# EAGLE board Bhoreal Slimpro (EAGLE 7.7.0), part 1 of 4
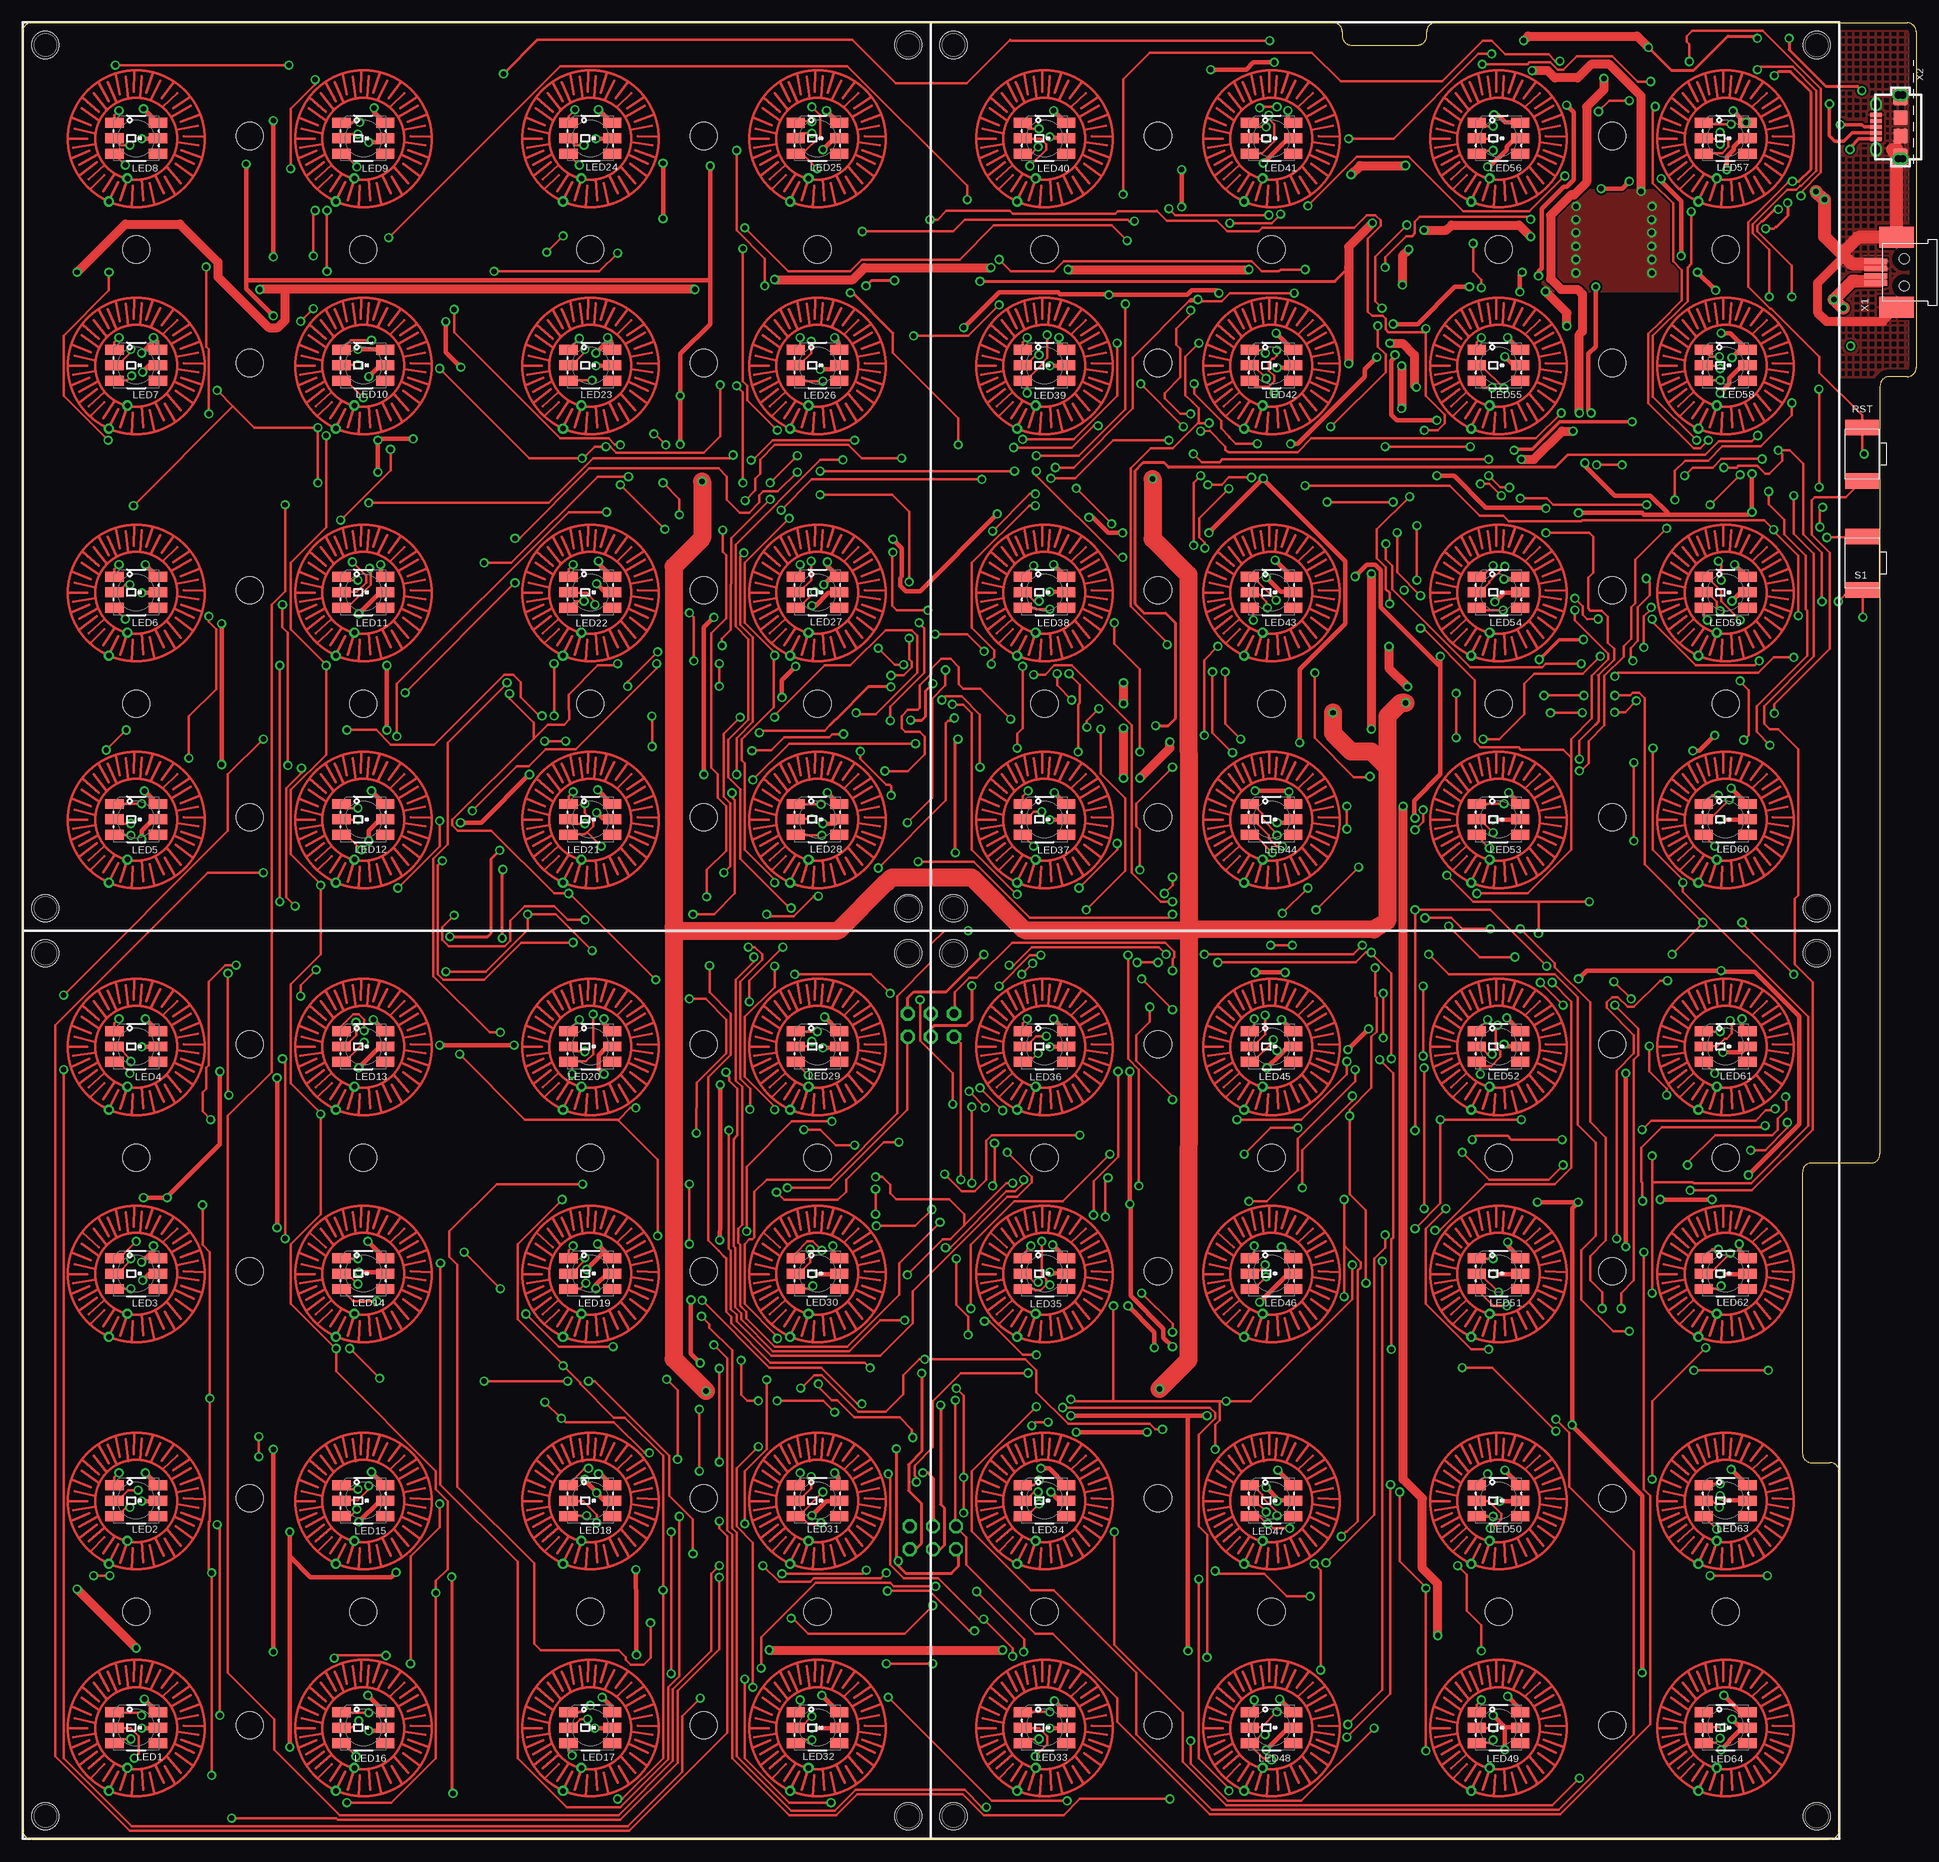
[diagram p8: board, top side]
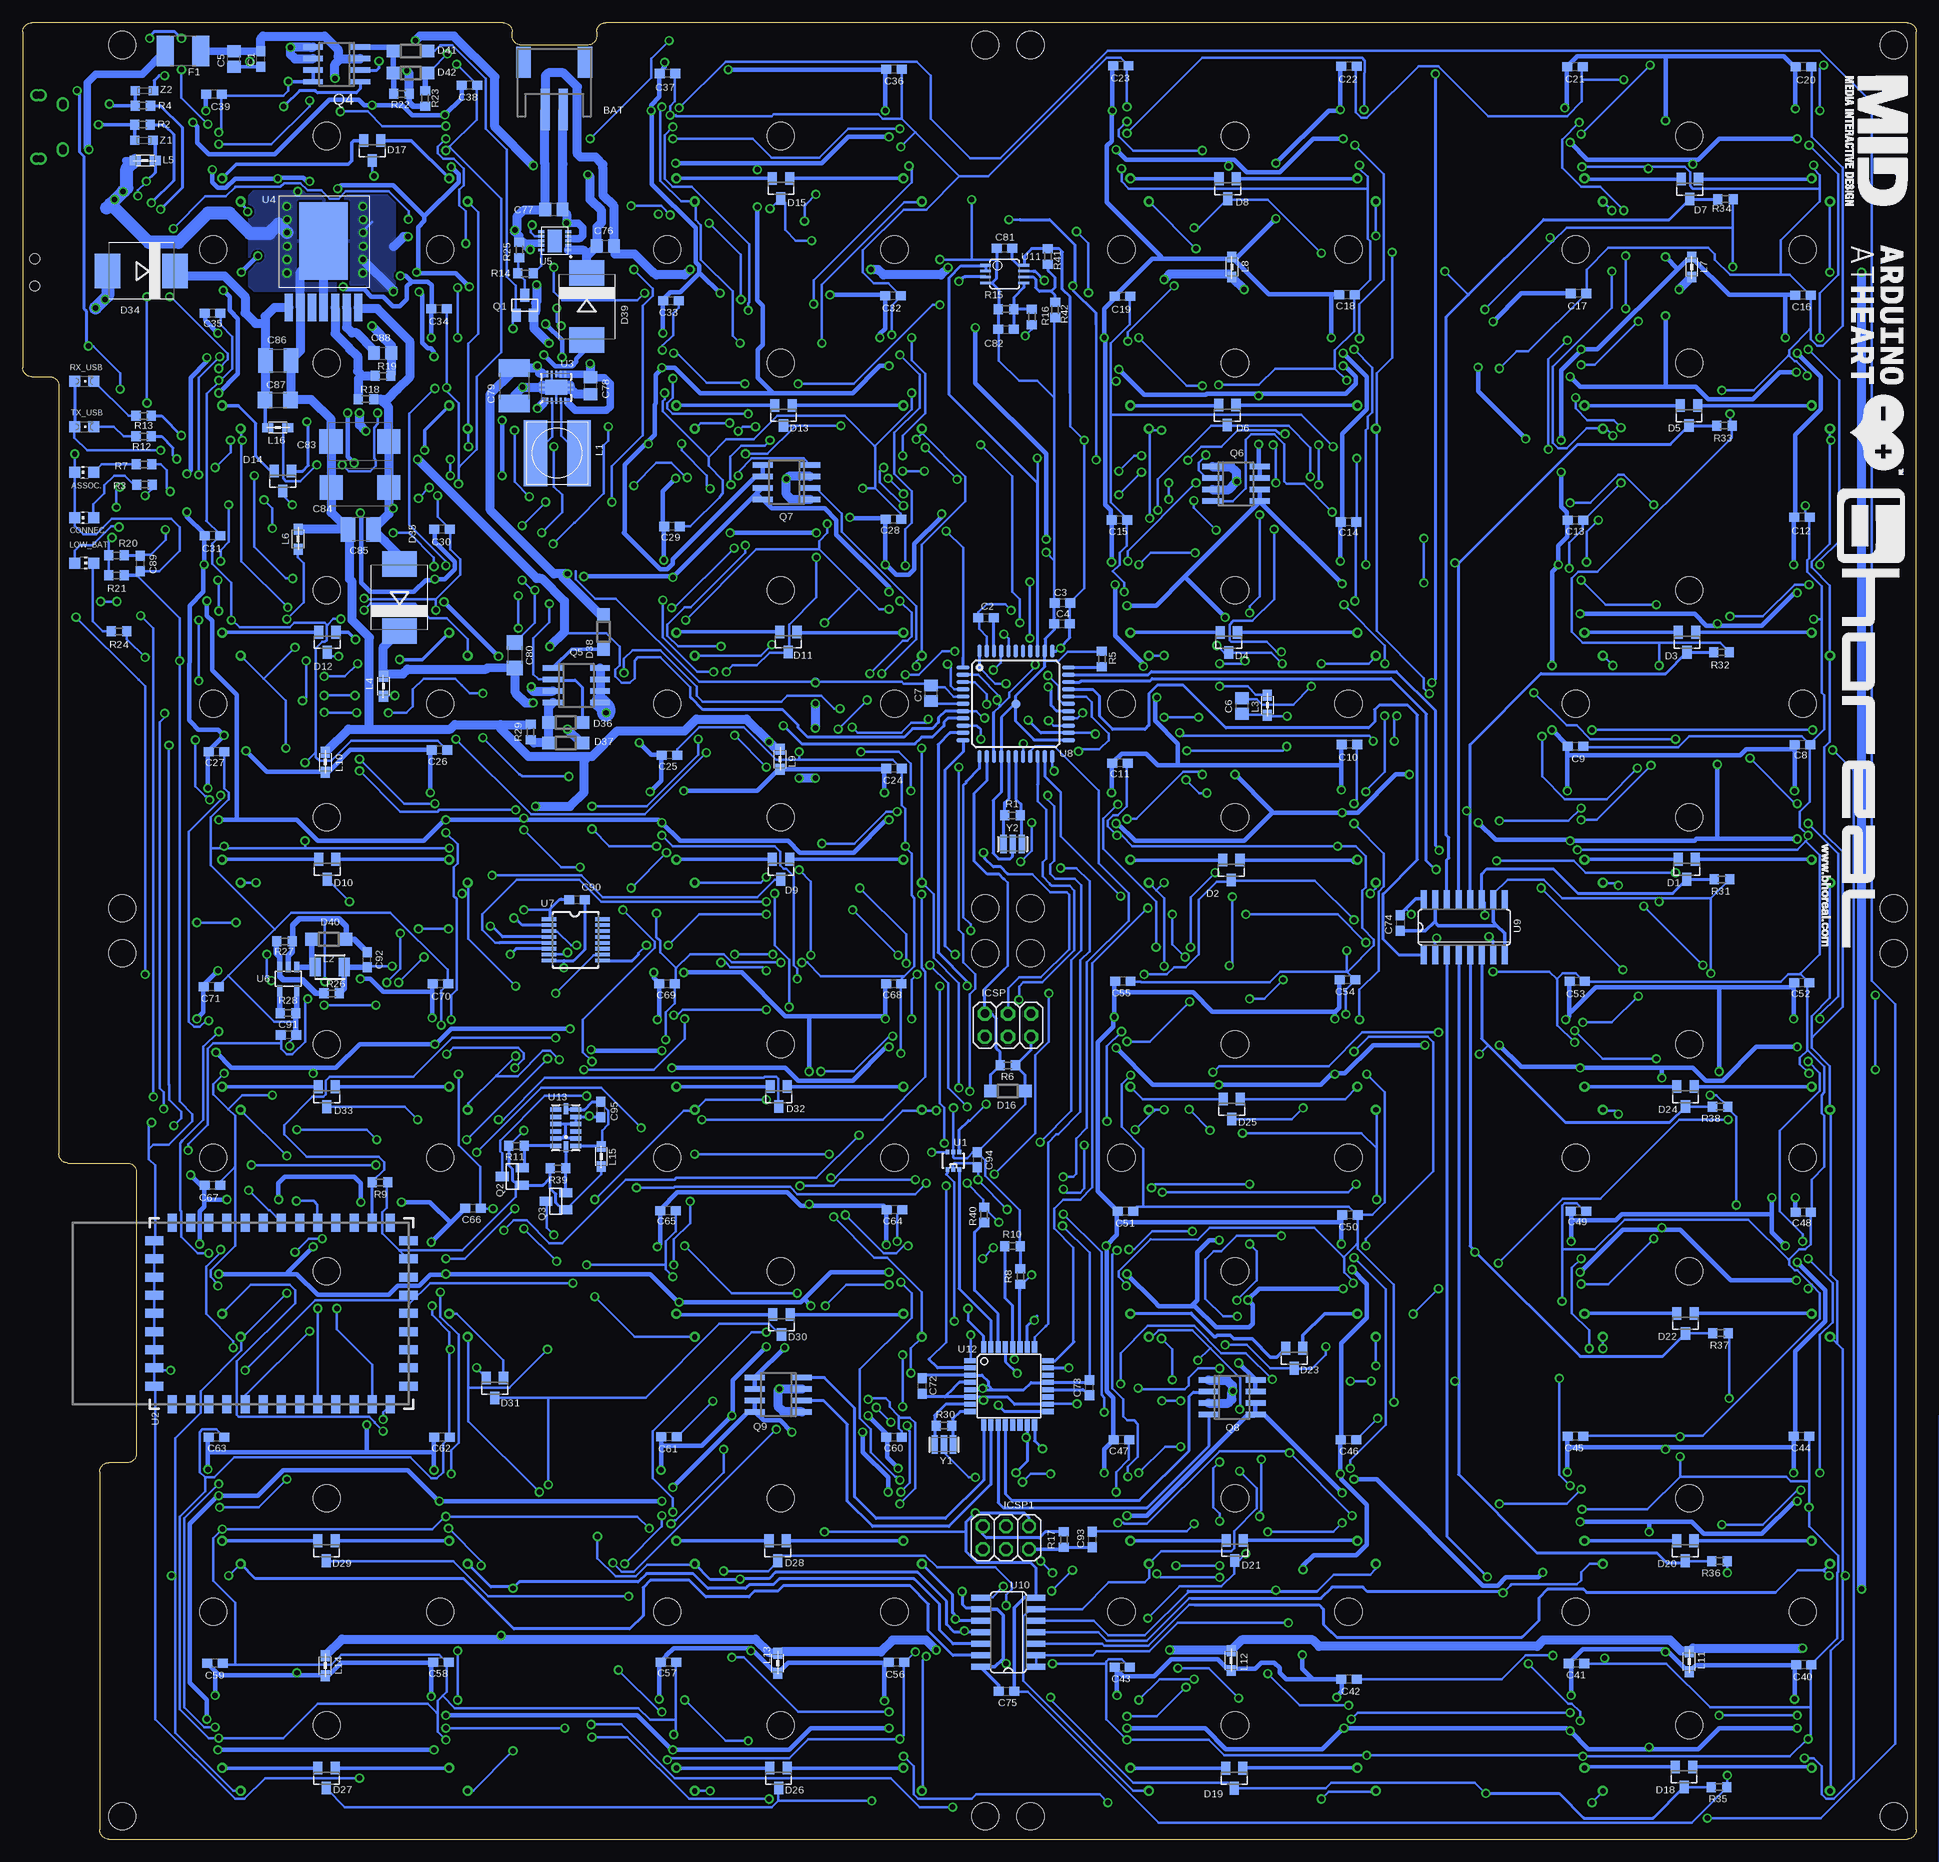
[diagram p9: board, bottom side, seen from below]

Size 208.48 x 200 mm. Coordinates in mm from the lower left corner, seen from the top.
Outline: 208.48,191.36 208.48,191.24
Outline: 208.48,190.53 208.48,190.37
Outline: 208.48,186.61 208.48,186.49
Outline: 208.48,185.78 208.48,185.62
Outline: 198.98,41.45 196.98,41.45 arc-91 195.96,42.44 195.96,73.46 arc-90 196.98,74.45 203.5,74.45 arc91 204.5,75.46 204.5,159.99 arc-91 205.49,161.01 207.49,161.01 arc90 208.48,162 208.48,199.01 arc90 207.49,200 155.6,200 arc89 154.58,199.01 154.58,198.53 arc-90 153.59,197.54 146.3,197.54 arc-91 145.29,198.53 145.29,199.01 arc89 144.3,200
Outline: 198.98,41.45 arc-91 200,40.46 200,1.02 arc-91 198.98,0 0.99,0 arc-90 0,1.02 0,199.01 arc-89 0.99,200 144.3,200
Copper layers (1*16): Top 0.035mm / dielectric 1.5mm / Bottom 0.035mm
Design rules "default *": minimum track width 10mil, minimum drill 0.6mm, track to track 8mil, track to pad 8mil, pad to pad 8mil, via to via 8mil, smd to smd 8mil, copper to edge 30mil, drill to drill 20mil, minimum pad ring 10mil, minimum via ring 0.2mm, stop-mask expansion 5mil, vias tented up to drill 0mil, thermal gap 10mil
Net classes: 1 power: width 1 mm, drill 0.6 mm, clearance 0.203 mm; 2 gnd: width 0.254 mm, drill 0.6 mm, clearance 0.203 mm; 3 usbvcc: width 0.254 mm, drill 0.6 mm, clearance 0.203 mm; 4 power_led: width 0.5 mm, drill 0.6 mm, clearance 0.203 mm

## Footprints (pad centres in the part's own frame; a part is rotated, then mirrored left to right if it is on the bottom)
CHIP-LED0805 = smd 1.2 x 1.2: A 0,-1.05; C 0,1.05
BUTTONPAD_WS2812 = smd 1.1 x 2: 1A 13.95,89.9; 1B 38.95,89.9; 1C 63.95,89.9; 1D 88.95,89.9; 1E 13.95,64.9; 1F 38.95,64.9; 1G 63.95,64.9; 1H 88.95,64.9; 1I 13.95,39.9; 1J 38.95,39.9; 1K 63.95,39.9; 1L 88.95,39.9; 1M 13.95,14.9; 1N 38.95,14.9; 1O 63.95,14.9; 1P 88.95,14.9; 2A 12.25,89.9; 2B 37.25,89.9; 2C 62.25,89.9; 2D 87.25,89.9; 2E 12.25,64.9; 2F 37.25,64.9; 2G 62.25,64.9; 2H 87.25,64.9; 2I 12.25,39.9; 2J 37.25,39.9; 2K 62.25,39.9; 2L 87.25,39.9; 2M 12.25,14.9; 2N 37.25,14.9; 2O 62.25,14.9; 2P 87.25,14.9; 3A 10.55,89.9; 3B 35.55,89.9; 3C 60.55,89.9; 3D 85.55,89.9; 3E 10.55,64.9; 3F 35.55,64.9; 3G 60.55,64.9; 3H 85.55,64.9; 3I 10.55,39.9; 3J 35.55,39.9; 3K 60.55,39.9; 3L 85.55,39.9; 3M 10.55,14.9; 3N 35.55,14.9; 3O 60.55,14.9; 3P 85.55,14.9; 4A 10.55,85.1; 4B 35.55,85.1; 4C 60.55,85.1; 4D 85.55,85.1; 4E 10.55,60.1; 4F 35.55,60.1; 4G 60.55,60.1; 4H 85.55,60.1; 4I 10.55,35.1; 4J 35.55,35.1; 4K 60.55,35.1; 4L 85.55,35.1; 4M 10.55,10.1; 4N 35.55,10.1; 4O 60.55,10.1; 4P 85.55,10.1; 5A 12.25,85.1; 5B 37.25,85.1; 5C 62.25,85.1; 5D 87.25,85.1; 5E 12.25,60.1; 5F 37.25,60.1; 5G 62.25,60.1; 5H 87.25,60.1; 5I 12.25,35.1; 5J 37.25,35.1; 5K 62.25,35.1; 5L 87.25,35.1; 5M 12.25,10.1; 5N 37.25,10.1; 5O 62.25,10.1; 5P 87.25,10.1; 6A 13.95,85.1; 6B 38.95,85.1; 6C 63.95,85.1; 6D 88.95,85.1; 6E 13.95,60.1; 6F 38.95,60.1; 6G 63.95,60.1; 6H 88.95,60.1; 6I 13.95,35.1; 6J 38.95,35.1; 6K 63.95,35.1; 6L 88.95,35.1; 6M 13.95,10.1; 6N 38.95,10.1; 6O 63.95,10.1; 6P 88.95,10.1 | drill 0.6: SIG1A 5.287,90.51; SIG1B 30.287,90.51; SIG1C 55.287,90.51; SIG1D 80.287,90.51; SIG1E 5.287,65.51; SIG1F 30.287,65.51; SIG1G 55.287,65.51; SIG1H 80.287,65.51; SIG1I 5.287,40.51; SIG1J 30.287,40.51; SIG1K 55.287,40.51; SIG1L 80.287,40.51; SIG1M 5.287,15.51; SIG1N 30.287,15.51; SIG1O 55.287,15.51; SIG1P 80.287,15.51; SIG2A 7.827,88.478; SIG2B 32.827,88.478; SIG2C 57.827,88.478; SIG2D 82.827,88.478; SIG2E 7.827,63.478; SIG2F 32.827,63.478; SIG2G 57.827,63.478; SIG2H 82.827,63.478; SIG2I 7.827,38.478; SIG2J 32.827,38.478; SIG2K 57.827,38.478; SIG2L 82.827,38.478; SIG2M 7.827,13.478; SIG2N 32.827,13.478; SIG2O 57.827,13.478; SIG2P 82.827,13.478 | hole 3: 12.499,24.997; 24.999,37.497; 37.499,24.997; 24.999,12.497; 62.499,24.997; 74.999,37.497; 87.499,24.997; 74.999,12.497; 12.499,74.997; 24.999,87.497; 37.499,74.997; 24.999,62.497; 62.499,74.997; 74.999,87.497; 87.499,74.997; 74.999,62.497; 2.483,97.513; 97.515,97.513; 97.515,2.481; 2.483,2.481
S2B-PH = smd 1 x 4.6: 1 -1,-3.7; 2 1,-3.7 | smd 1.6 x 3.4: NC1 -3.4,1.5; NC2 3.4,1.5
C0603 = smd 1.1 x 1: 1 -0.85,0; 2 0.85,0
C0805 = smd 1.3 x 1.5: 1 -0.85,0; 2 0.85,0
C0805' = smd 1.3 x 1.5: 1 -0.95,0; 2 0.95,0
C1812 = smd 1.9 x 3.4: 1 -1.95,0; 2 1.95,0
C1206 = smd 1.6 x 1.8: 1 -1.4,0; 2 1.4,0
D/7343-31R = smd 2.55 x 2.7: + 3.175,0; - -3.175,0
C1210 = smd 1.6 x 2.7: 1 -1.4,0; 2 1.4,0
SOT23 = smd 1 x 1.4: 1 -0.95,-1.1; 2 0.95,-1.1; 3 0,1.1
SOD123 = smd 1.4 x 1.4: A 1.9,0; C -1.9,0
SMC = smd 2.8 x 3.8: A 3.7,0; C -3.7,0
L1812 = smd 1.9 x 3.4: 1 -1.95,0; 2 1.95,0
2X03 = drill 0.95 pad 1.55 octagon: 1 -2.54,-1.27; 2 -2.54,1.27; 3 0,-1.27; 4 0,1.27; 5 2.54,-1.27; 6 2.54,1.27
2X03' = drill 1.016 octagon: 1 -2.54,-1.27; 2 -2.54,1.27; 3 0,-1.27; 4 0,1.27; 5 2.54,-1.27; 6 2.54,1.27
SRR6038 = smd 7.3 x 2.6: P$1 0,2.4; P$2 0,-2.4
1210 = smd 1.2 x 2: 1 -1.6,0; 2 1.6,0
0805 = smd 1.2 x 1: 1 -1.1,0; 2 1.1,0
SO8 = smd 0.6 x 2.2: 1 -1.905,-2.6; 2 -0.635,-2.6; 3 0.635,-2.6; 4 1.905,-2.6; 5 1.905,2.6; 6 0.635,2.6; 7 -0.635,2.6; 8 -1.905,2.6
R0603 = smd 1 x 1.1: 1 -0.85,0; 2 0.85,0
KSS241G = smd 1.7 x 3.7: 1 -2.95,0; 2 2.95,0
CHIPLED_0805 = smd 1.2 x 1.2: A 0,-1.05; C 0,1.05
SC70 = smd 0.4 x 0.5: 1 -0.65,-0.95; 2 0,-0.95; 3 0.65,-0.95; 4 0.65,0.95; 5 0,0.95; 6 -0.65,0.95
RN-131G = smd 2 x 1: P$1 -10,11; P$2 -10,9; P$3 -10,7; P$4 -10,5; P$5 -10,3; P$6 -10,1; P$7 -10,-1; P$8 -10,-3; P$9 -10,-5; P$10 -10,-7; P$11 -10,-9; P$12 -10,-11; P$13 -10,-13; P$23 10,-13; P$24 10,-11; P$25 10,-9; P$26 10,-7; P$27 10,-5; P$28 10,-3; P$29 10,-1; P$30 10,1; P$31 10,3; P$32 10,5; P$33 10,7; P$34 10,9; P$35 10,11 | smd 1 x 2: P$14 -8,-15; P$15 -6,-15; P$16 -4,-15; P$17 -2,-15; P$18 0,-15; P$19 2,-15; P$20 4,-15; P$21 6,-15; P$22 8,-15; P$36 8,13; P$37 6,13; P$38 4,13; P$39 2,13; P$40 0,13; P$41 -2,13; P$42 -4,13; P$43 -6,13; P$44 -8,13
QFN-10_PAD = smd 0.25 x 0.7: 1 -1,-1.475; 2 -0.5,-1.475; 3 0,-1.475; 4 0.5,-1.475; 5 1,-1.475; 6 1,1.475; 7 0.5,1.475; 8 0,1.475; 9 -0.5,1.475; 10 -1,1.475 | smd 0.7 x 0.25: 11 -1.5,0.25; 12 -1.5,-0.25; 13 1.5,0.25; 14 1.5,-0.25 | smd 2.4 x 1.65: 15 0,0
TO-PMOD = smd 0.89 x 3.06: 1 -3.81,-7.305; 2 -2.54,-7.305; 3 -1.27,-7.305; 4 0,-7.305; 5 1.27,-7.305; 6 2.54,-7.305; 7 3.81,-7.305 | smd 5.35 x 8.54: 8 0,0
DFN-10 = smd 0.3 x 0.65: 1 -1,-1.5; 2 -0.5,-1.5; 3 0,-1.5; 4 0.5,-1.5; 5 1,-1.5; 6 1,1.5; 7 0.5,1.5; 8 0,1.5; 9 -0.5,1.5; 10 -1,1.5 | smd 2.48 x 1.55: 11 0,0
SOT23-5L = smd 0.55 x 1.2: 1 -0.95,-1.3; 2 0,-1.3; 3 0.95,-1.3; 4 0.95,1.3; 5 -0.95,1.3
TSSOP16 = smd 0.4 x 1.6: 1 -2.225,-2.85; 2 -1.575,-2.85; 3 -0.925,-2.85; 4 -0.275,-2.85; 5 0.375,-2.85; 6 1.025,-2.85; 7 1.675,-2.85; 8 2.325,-2.85; 9 2.325,3.05; 10 1.675,3.05; 11 1.025,3.05; 12 0.375,3.05; 13 -0.275,3.05; 14 -0.925,3.05; 15 -1.575,3.05; 16 -2.225,3.05
TQFP44-PAD = smd 1.4 x 0.45: 1 -5.8,4; 2 -5.8,3.2; 3 -5.8,2.4; 4 -5.8,1.6; 5 -5.8,0.8; 6 -5.8,0; 7 -5.8,-0.8; 8 -5.8,-1.6; 9 -5.8,-2.4; 10 -5.8,-3.2; 11 -5.8,-4; 23 5.8,-4; 24 5.8,-3.2; 25 5.8,-2.4; 26 5.8,-1.6; 27 5.8,-0.8; 28 5.8,0; 29 5.8,0.8; 30 5.8,1.6; 31 5.8,2.4; 32 5.8,3.2; 33 5.8,4 | smd 0.45 x 1.4: 12 -4,-5.8; 13 -3.2,-5.8; 14 -2.4,-5.8; 15 -1.6,-5.8; 16 -0.8,-5.8; 17 0,-5.8; 18 0.8,-5.8; 19 1.6,-5.8; 20 2.4,-5.8; 21 3.2,-5.8; 22 4,-5.8; 34 4,5.8; 35 3.2,5.8; 36 2.4,5.8; 37 1.6,5.8; 38 0.8,5.8; 39 0,5.8; 40 -0.8,5.8; 41 -1.6,5.8; 42 -2.4,5.8; 43 -3.2,5.8; 44 -4,5.8 | smd 1 x 1: P$1 0,0
SO16 = smd 0.66 x 2.032: 1 -4.445,-3.073; 2 -3.175,-3.073; 3 -1.905,-3.073; 4 -0.635,-3.073; 5 0.635,-3.073; 6 1.905,-3.073; 7 3.175,-3.073; 8 4.445,-3.073; 9 4.445,3.073; 10 3.175,3.073; 11 1.905,3.073; 12 0.635,3.073; 13 -0.635,3.073; 14 -1.905,3.073; 15 -3.175,3.073; 16 -4.445,3.073
SO14 = smd 0.66 x 2.032: 1 -3.81,-3.073; 2 -2.54,-3.073; 3 -1.27,-3.073; 4 0,-3.073; 5 1.27,-3.073; 6 2.54,-3.073; 7 3.81,-3.073; 8 3.81,3.073; 9 2.54,3.073; 10 1.27,3.073; 11 0,3.073; 12 -1.27,3.073; 13 -2.54,3.073; 14 -3.81,3.073
MSOP08 = smd 0.3 x 1.2: 1 -0.976,-2.113; 2 -0.326,-2.113; 3 0.324,-2.113; 4 0.974,-2.113; 5 0.974,2.112; 6 0.324,2.112; 7 -0.326,2.112; 8 -0.976,2.112
TQFP32-08 = smd 1.27 x 0.559: 1 -4.293,2.8; 2 -4.293,2; 3 -4.293,1.2; 4 -4.293,0.4; 5 -4.293,-0.4; 6 -4.293,-1.2; 7 -4.293,-2; 8 -4.293,-2.8; 17 4.293,-2.8; 18 4.293,-2; 19 4.293,-1.2; 20 4.293,-0.4; 21 4.293,0.4; 22 4.293,1.2; 23 4.293,2; 24 4.293,2.8 | smd 0.559 x 1.27: 9 -2.8,-4.293; 10 -2,-4.293; 11 -1.2,-4.293; 12 -0.4,-4.293; 13 0.4,-4.293; 14 1.2,-4.293; 15 2,-4.293; 16 2.8,-4.293; 25 2.8,4.293; 26 2,4.293; 27 1.2,4.293; 28 0.4,4.293; 29 -0.4,4.293; 30 -1.2,4.293; 31 -2,4.293; 32 -2.8,4.293
LGA14 = smd 0.5 x 1.2: 1 2,1.1; 2 1.2,1.1; 3 0.4,1.1; 4 -0.4,1.1; 5 -1.2,1.1; 6 -2,1.1; 8 -2,-1.1; 9 -1.2,-1.1; 10 -0.4,-1.1; 11 0.4,-1.1; 12 1.2,-1.1; 13 2,-1.1 | smd 1.2 x 0.5: 7 -2.1,0; 14 2.1,0
MQ172X-4PA(55) = smd 0.55 x 2.5: 1 -1.2,3.15; 2 -0.4,3.15; 3 0.4,3.15; 4 1.2,3.15 | smd 2.3 x 3.8: P$1 -3.85,0.85; P$2 3.85,0.85 | hole 1.1: -1.5,0; 1.5,0
CON2_USB_MICRO_B_AT = smd 0.406 x 1.346: P1 -1.321,2.692; P2 -0.66,2.692; P3 0,2.692; P4 0.66,2.692; P5 1.321,2.692 | drill 0.8 pad 1.27: P$1 -2.616,2.692 | drill 0.8 pad 1.245: P$2 -2.362,2.692; P$7 2.362,2.692; P$8 2.616,2.692 | drill 0.8 pad 1.143: P$3 -3.505,-0.254; P$4 -3.505,0.254; P$5 3.505,0.254; P$6 3.505,-0.254 | smd 1.778 x 1.651: S1 -3.302,0; S2 3.302,0 | smd 1.524 x 1.27: S3 -2.489,2.692; S4 2.489,2.692 | smd 1.626 x 1.524: S5 -1.016,0; S6 1.016,0
RESONATOR = smd 0.7 x 2: 1 -1,0; 2 0,0; 3 1,0
CT/CN0603 = smd 1 x 1: 1 -1,0; 2 1,0

## Placement (x,y rotation side)
ASSOC.  598-8191-107F  [CHIP-LED0805]  201.69,150.49 90 bottom
B1  BUTTONPAD_WS2812  [BUTTONPAD_WS2812]  100,100.03 90 top
B2  BUTTONPAD_WS2812  [BUTTONPAD_WS2812]  200,100.03 90 top
B3  BUTTONPAD_WS2812  [BUTTONPAD_WS2812]  100,0.03 90 top
B4  BUTTONPAD_WS2812  [BUTTONPAD_WS2812]  200,0.03 90 top
BAT  S2B-PH-SM4-TB(LF)(SN)  [S2B-PH]  149.95,194.14 0 bottom
C1  100n  [C0603]  182.26,196.01 90 bottom
C2  100n  [C0603]  102.4,134.51 0 bottom
C3  100n  [C0603]  94,136.11 180 bottom
C4  100n  [C0603]  94.04,133.81 180 bottom
C5  10u  [C0805]  185.22,196.01 90 bottom
C6  1u  [C0805]  74.24,124.77 270 bottom
C7  1u  [C0805]  108.48,126.17 270 bottom
C8  10n  [C0603]  12.54,120.51 180 bottom
C9  10n  [C0603]  37.52,120.33 180 bottom
C10  10n  [C0603]  62.38,120.53 180 bottom
C11  10n  [C0603]  87.68,118.49 180 bottom
C12  10n  [C0603]  12.58,145.57 180 bottom
C13  10n  [C0603]  37.5,145.21 180 bottom
C14  10n  [C0603]  62.5,145.03 180 bottom
C15  10n  [C0603]  87.74,145.25 180 bottom
C16  10n  [C0603]  12.48,169.99 180 bottom
C17  10n  [C0603]  37.2,170.19 180 bottom
C18  10n  [C0603]  62.66,170.05 180 bottom
C19  10n  [C0603]  87.4,169.87 180 bottom
C20  10n  [C0603]  12.4,195.15 180 bottom
C21  10n  [C0603]  37.58,195.17 180 bottom
C22  10n  [C0603]  62.46,195.21 180 bottom
C23  10n  [C0603]  87.58,195.27 180 bottom
C24  10n  [C0603]  112.56,117.89 180 bottom
C25  10n  [C0603]  137.26,119.37 180 bottom
C26  10n  [C0603]  162.6,119.93 180 bottom
C27  10n  [C0603]  187.16,119.75 180 bottom
C28  10n  [C0603]  112.6,145.35 180 bottom
C29  10n  [C0603]  137,144.53 180 bottom
C30  10n  [C0603]  162.32,144.23 180 bottom
C31  10n  [C0603]  187.58,143.51 180 bottom
C32  10n  [C0603]  112.64,169.93 180 bottom
C33  10n  [C0603]  137.12,169.37 180 bottom
C34  10n  [C0603]  162.64,168.49 180 bottom
C35  10n  [C0603]  187.6,168.01 180 bottom
C36  10n  [C0603]  112.56,194.89 180 bottom
C37  10n  [C0603]  137.5,194.41 180 bottom
C38  10n  [C0603]  159.3,193.13 180 bottom
C39  10n  [C0603]  187.44,192.13 180 bottom
C40  10n  [C0603]  12.38,19.21 180 bottom
C41  10n  [C0603]  37.38,19.35 180 bottom
C42  10n  [C0603]  62.44,17.61 180 bottom
C43  10n  [C0603]  87.42,18.93 180 bottom
C44  10n  [C0603]  12.64,44.35 180 bottom
C45  10n  [C0603]  37.52,44.37 180 bottom
C46  10n  [C0603]  62.5,43.99 180 bottom
C47  10n  [C0603]  87.5,43.99 180 bottom
C48  10n  [C0603]  12.44,69.03 180 bottom
C49  10n  [C0603]  37.2,69.15 180 bottom
C50  10n  [C0603]  62.36,68.73 180 bottom
C51  10n  [C0603]  87.08,69.15 180 bottom
C52  10n  [C0603]  12.6,94.31 180 bottom
C53  10n  [C0603]  37.32,94.45 180 bottom
C54  10n  [C0603]  62.62,94.61 180 bottom
C55  10n  [C0603]  87.36,94.47 180 bottom
C56  10n  [C0603]  112.26,19.49 180 bottom
C57  10n  [C0603]  137.4,19.49 180 bottom
C58  10n  [C0603]  162.44,19.49 180 bottom
C59  10n  [C0603]  187.3,19.39 180 bottom
C60  10n  [C0603]  112.54,44.25 180 bottom
C61  10n  [C0603]  137.3,44.33 180 bottom
C62  10n  [C0603]  162.32,44.27 180 bottom
C63  10n  [C0603]  187.16,44.27 180 bottom
C64  10n  [C0603]  112.5,69.31 180 bottom
C65  10n  [C0603]  137.44,69.21 180 bottom
C66  10n  [C0603]  158.92,69.45 180 bottom
C67  10n  [C0603]  187.6,71.99 180 bottom
C68  10n  [C0603]  112.58,94.17 180 bottom
C69  10n  [C0603]  137.52,94.17 180 bottom
C70  10n  [C0603]  162.48,94.17 180 bottom
C71  10n  [C0603]  187.72,93.87 180 bottom
C72  100n  [C0603]  109.44,49.91 90 bottom
C73  100n  [C0603]  91.02,49.71 90 bottom
C74  100n  [C0603]  56.82,100.87 270 bottom
C75  100n  [C0603]  100.14,16.29 0 bottom
C76  4.7u  [C0805']  144.32,175.41 0 bottom
C77  4.7u  [C0805']  150,179.43 180 bottom
C78  2.2u  [C0805']  145.98,160.03 270 bottom
C79  47u  [C1812]  154.38,160.03 270 bottom
C80  100u  [C1206]  154.3,130.37 270 bottom
C81  100n  [C0603]  100.4,175.19 180 bottom
C82  100n  [C0603]  100.2,166.23 0 bottom
C83  100u  [D/7343-31R]  171.36,153.89 0 bottom
C84  100u  [D/7343-31R]  171.34,148.85 0 bottom
C85  100u  [C1210]  171.26,144.23 180 bottom
C86  10u  [C1210]  180.36,162.83 0 bottom
C87  47n  [C1206]  180.4,158.45 0 bottom
C88  470n  [C0805']  168.86,163.63 0 bottom
C89  100n  [C0603]  195.52,140.47 90 bottom
C90  100n  [C0603]  147.46,103.45 0 bottom
C91  4.7u  [C0603]  179.24,88.55 180 bottom
C92  4.7u  [C0603]  170.56,96.83 90 bottom
C93  100n  [C0603]  90.7,32.99 90 bottom
C94  100n  [C0603]  103.38,74.81 270 bottom
C95  100n  [C0603]  144.86,80.33 270 bottom
CONNEC.  598-8191-107F  [CHIP-LED0805]  201.69,145.5 90 bottom
D1  BAV70LT3G  [SOT23]  25.26,106.79 180 bottom
D2  BAV70LT3G  [SOT23]  75.4,106.71 180 bottom
D3  BAV70LT3G  [SOT23]  25.24,131.79 180 bottom
D4  BAV70LT3G  [SOT23]  75.68,131.77 180 bottom
D5  BAV70LT3G  [SOT23]  25.02,156.75 180 bottom
D6  BAV70LT3G  [SOT23]  75.84,156.81 180 bottom
D7  BAV70LT3G  [SOT23]  24.92,181.69 180 bottom
D8  BAV70LT3G  [SOT23]  75.82,181.73 180 bottom
D9  BAV70LT3G  [SOT23]  125,106.79 180 bottom
D10  BAV70LT3G  [SOT23]  174.96,106.79 180 bottom
D11  BAV70LT3G  [SOT23]  124.18,131.83 180 bottom
D12  BAV70LT3G  [SOT23]  174.94,131.79 180 bottom
D13  BAV70LT3G  [SOT23]  124.72,156.77 180 bottom
D14  BAV70LT3G  [SOT23]  179.84,149.53 180 bottom
D15  BAV70LT3G  [SOT23]  125,181.75 180 bottom
D16  MBR0530T1G  [SOD123]  100,82.37 180 bottom
D17  BAV70LT3G  [SOT23]  170,185.93 180 bottom
D18  BAV70LT3G  [SOT23]  25.56,6.85 180 bottom
D19  BAV70LT3G  [SOT23]  75.08,6.71 180 bottom
D20  BAV70LT3G  [SOT23]  25.42,31.75 180 bottom
D21  BAV70LT3G  [SOT23]  75.04,31.79 180 bottom
D22  BAV70LT3G  [SOT23]  25.4,56.79 180 bottom
D23  BAV70LT3G  [SOT23]  68.48,52.95 180 bottom
D24  BAV70LT3G  [SOT23]  25.4,81.77 180 bottom
D25  BAV70LT3G  [SOT23]  75.36,80.39 180 bottom
D26  BAV70LT3G  [SOT23]  125.26,6.73 180 bottom
D27  BAV70LT3G  [SOT23]  175.04,6.73 180 bottom
D28  BAV70LT3G  [SOT23]  125.36,31.75 180 bottom
D29  BAV70LT3G  [SOT23]  175.04,31.75 180 bottom
D30  BAV70LT3G  [SOT23]  124.94,56.67 180 bottom
D31  BAV70LT3G  [SOT23]  156.5,49.67 180 bottom
D32  BAV70LT3G  [SOT23]  125.24,81.77 180 bottom
D33  BAV70LT3G  [SOT23]  175,81.75 180 bottom
D34  MBRS540T3G  [SMC]  195.43,172.64 180 bottom
D35  MBRS540T3G  [SMC]  166.99,136.72 90 bottom
D36  MBR0530T1G  [SOD123]  148.68,122.95 0 bottom
D37  MBR0530T1G  [SOD123]  148.68,120.71 0 bottom
D38  MBR0530T1G  [SOD123]  144.54,132.92 90 bottom
D39  MBRS540T3G  [SMC]  146.38,168.75 270 bottom
D40  MBR0530T1G  [SOD123]  174.78,99.09 0 bottom
D41  MBR0530T1G  [SOD123]  165.78,196.89 0 bottom
D42  MBR0530T1G  [SOD123]  165.78,194.47 0 bottom
F1  MF-MSMF050-2 500mA  [L1812]  190.84,196.89 180 bottom
ICSP  ICSP  [2X03]  100,89.63 180 bottom
ICSP1  ICSP  [2X03']  100.22,33.19 0 bottom
L1  SRR6038-3R3YCT  [SRR6038]  149.64,152.61 270 bottom
L2  4.7u  [1210]  174.66,96.03 0 bottom
L3  MH2029-300Y  [0805]  71.44,124.85 270 bottom
L4  MH2029-300Y  [0805]  168.76,126.95 90 bottom
L5  MH2029-300Y  [0805]  195,184.83 0 bottom
L6  MH2029-300Y  [0805]  178.16,143.15 270 bottom
L7  MH2029-300Y  [0805]  24.72,173.11 90 bottom
L8  MH2029-300Y  [0805]  75.34,173.11 90 bottom
L9  MH2029-300Y  [0805]  125.1,118.91 270 bottom
L10  MH2029-300Y  [0805]  175.16,118.59 270 bottom
L11  MH2029-300Y  [0805]  25,19.55 270 bottom
L12  MH2029-300Y  [0805]  75.44,19.67 270 bottom
L13  MH2029-300Y  [0805]  125.36,19.37 270 bottom
L14  MH2029-300Y  [0805]  175.18,19.11 270 bottom
L15  MH2029-300Y  [0805]  144.78,75.17 90 bottom
L16  MH2029-300Y  [0805]  180.4,155.43 180 bottom
LOW_BAT  598-8110-107F  [CHIP-LED0805]  201.69,140.5 270 bottom
Q1  BS170  [SOT23]  153.2,168.89 0 bottom
Q2  BS170  [SOT23]  154.58,72.97 90 bottom
Q3  BS170  [SOT23]  149.78,70.25 90 bottom
Q4  SI9933CDY-T1-E3  [SO8]  173.92,195.41 90 bottom
Q5  SI9933CDY-T1-E3  [SO8]  147.52,127.05 270 bottom
Q6  SI9933CDY-T1-E3  [SO8]  74.9,149.23 270 bottom
Q7  SI9933CDY-T1-E3  [SO8]  124.38,149.41 90 bottom
Q8  SI9933CDY-T1-E3  [SO8]  75.32,48.65 270 bottom
Q9  SI9933CDY-T1-E3  [SO8]  125.28,48.95 90 bottom
R1  1M  [R0603]  99.52,112.73 180 bottom
R2  22  [R0603]  195.28,188.79 0 bottom
R3  1k  [R0603]  195.06,149.15 180 bottom
R4  22  [R0603]  195.26,190.87 0 bottom
R5  10k  [R0603]  89.66,129.95 270 bottom
R6  10k  [R0603]  100.02,85.21 0 bottom
R7  1k  [R0603]  195.12,151.37 180 bottom
R8  4k7  [R0603]  98.64,61.97 90 bottom
R9  10k  [R0603]  169.16,72.31 0 bottom
R10  4k7  [R0603]  99.5,65.31 0 bottom
R11  3k3  [R0603]  154.12,76.33 180 bottom
R12  1k  [R0603]  195.16,154.45 180 bottom
R13  1k  [R0603]  195.16,156.71 180 bottom
R14  1k  [R0603]  153.14,172.41 0 bottom
R15  33k  [R0603]  100.2,168.47 180 bottom
R16  47k  [R0603]  97.36,167.61 90 bottom
R17  10k  [R0603]  93.84,32.99 90 bottom
R18  6k8  [R0603]  170.7,158.57 0 bottom
R19  1k2  [R0603]  168.82,161.13 0 bottom
R20  10k  [R0603]  198.16,141.35 0 bottom
R21  10k  [R0603]  198.16,139.15 180 bottom
R22  10k  [R0603]  166.76,192.17 0 bottom
R23  10k  [R0603]  164.18,191.67 90 bottom
R24  1k  [R0603]  197.88,132.99 180 bottom
R25  2k  [R0603]  153.8,174.99 270 bottom
R26  45k3  [R0603]  174.46,93.13 0 bottom
R27  10k  [R0603]  179.64,98.85 180 bottom
R28  10k  [R0603]  179.28,90.95 0 bottom
R29  10k  [R0603]  152.56,121.91 90 bottom
R30  1M  [R0603]  107.04,45.55 180 bottom
R31  10k  [R0603]  21.4,105.69 180 bottom
R32  10k  [R0603]  21.44,130.69 180 bottom
R33  10k  [R0603]  21.12,155.65 180 bottom
R34  10k  [R0603]  21,180.59 180 bottom
R35  10k  [R0603]  21.72,5.73 180 bottom
R36  10k  [R0603]  21.64,30.61 180 bottom
R37  10k  [R0603]  21.54,55.71 180 bottom
R38  10k  [R0603]  21.58,80.67 180 bottom
R39  3k3  [R0603]  149.54,73.85 180 bottom
R40  1k  [R0603]  102.62,68.75 270 bottom
R41  18k  [R0603]  95.61,174.27 270 bottom
R42  33k  [R0603]  94.82,168.39 270 bottom
RST  SWITCH-MOMENTARY-2KSS  [KSS241G]  202.53,152.5 270 top
RX_USB  598-8150-107F  [CHIPLED_0805]  201.69,160.52 270 bottom
S1  SWITCH-MOMENTARY-2KSS  [KSS241G]  202.54,140.5 270 top
TX_USB  598-8150-107F  [CHIPLED_0805]  201.69,155.5 270 bottom
U1  NC7SZ157P6X  [SC70]  106.02,74.69 0 bottom
U2  RN-131G  [RN-131G]  181,57.89 90 bottom
U3  TPS63002  [QFN-10_PAD]  149.74,159.85 0 bottom
U4  LMZ2200X  [TO-PMOD]  175.36,175.95 0 bottom
U5  MCP73113/4  [DFN-10]  149.9,175.99 90 bottom
U6  LMR10510  [SOT23-5L]  179.24,94.73 180 bottom
U7  74HC4050PWR  [TSSOP16]  147.7,99.07 270 bottom
U8  ATMEGA32U4-XUAU  [TQFP44-PAD]  99.14,125.01 0 bottom
U9  74HC165D  [SO16]  49.76,100.41 0 bottom
U10  74HC164D  [SO14]  99.96,22.79 90 bottom
U11  LMV358IDGKR  [MSOP08]  100.36,172.33 270 bottom
U12  ATMEGA328AU  [TQFP32-08]  99.88,49.89 0 bottom
U13  ADXL345  [LGA14]  148.68,78.33 270 bottom
X1  MQ172X-4PA(55)  [MQ172X-4PA(55)]  207.17,172.51 90 top
X2  USB-MICRO B  [CON2_USB_MICRO_B_AT]  206.75,188.53 90 top
Y1  CSTCE16M0V53-R0 16MHZ  [RESONATOR]  107.06,43.45 0 bottom
Y2  CSTCE16M0V53-R0 16MHZ  [RESONATOR]  99.48,109.57 0 bottom
Z1  CG0603MLC-05E  [CT/CN0603]  195.14,187.05 0 bottom
Z2  CG0603MLC-05E  [CT/CN0603]  195.08,192.51 0 bottom

## Tracks (layer width: path | path; a pad name or v marks a point on that pad's centre or on a via)
164-CLK  (via drill 0.6)
  Top 0.254: v100.5,27.83 95.9,27.83 95.5,28.23 87.3,28.23 81.3,22.23 v81.3,18.83 | v74.6,15.53 72.6,13.53 72.6,7.43 66.6,1.43 12,1.43 4.5,8.93 v4.5,84.73 | v4.5,92.93 22.6,111.03 22.6,117.23 v26.5,121.13 | v54.2,138.33 v42.1,126.23 | v54.2,143.23 54.7,143.23 62.4,150.93 76.62,150.93 77.52,150.03 77.52,147.49 78.94,146.07 79.98,146.07 81.1,147.19 81.1,147.97 81.52,148.39 83.16,148.39 v85.3,150.53 | v97.6,132.23 97.6,129.93 97.9,129.63 97.9,129.03 97,128.13 v95.6,128.13 | v87.8,148.03 95.74,148.03 97.6,146.17 v97.6,138.43 | v97.6,138.43
  Bottom 0.254: v100.5,27.83 101.7,26.63 103,26.63 U10.8 | v81.3,18.83 77.9,18.83 v74.6,15.53 | v4.5,92.93 v4.5,84.73 | v26.5,121.13 35.9,121.13 37.4,122.63 38.5,122.63 v42.1,126.23 | v54.2,143.23 v54.2,138.33 | v87.8,148.03 v85.3,150.53 | v97.6,132.23 v97.6,138.43 | v95.6,128.13 94.4,126.93 94.4,125.53 94,125.13 93.4,125.13 U8.28
164-IN  (via drill 0.6)
  Top 0.254: v92.24,119.77 92.24,118.95 95.08,116.11 95.46,116.11 95.62,115.95 v95.62,114.93 | v96.46,76.75 94.82,76.75 90.66,72.59 90.66,71.31 89.74,70.39 83.84,70.39 v83,71.23 | v61.66,72.13 52.18,72.13 46.98,66.93 46.98,64.11 47.86,63.23 47.86,38.83 56.32,30.37 56.32,21.53 57.06,20.79 65.62,20.79 66.4,20.01 66.4,19.75 66.96,19.19 68.36,19.19 69.14,19.97 69.14,23.79 v69.12,23.81
  Bottom 0.254: U10.1 U10.2 90.64,20.25 90.22,20.67 84.44,20.67 81.3,23.81 v69.12,23.81 | U8.29 91.4,125.81 90.78,125.19 90.78,123.58 88.92,121.73 88.92,120.99 89.94,119.98 92.03,119.98 v92.24,119.77 | v95.62,114.93 95.62,114.45 94.9,113.73 94.9,107.73 95.32,107.31 95.32,106.31 94.78,105.77 92.66,105.77 91.94,105.05 91.94,97.87 93.02,96.79 93.02,80.19 v96.46,76.75 | v83,71.23 62.56,71.23 v61.66,72.13
165-CLK  (via drill 0.6)
  Top 0.305: v52.8,99.21 52.8,106.71 v52.86,106.77
  Bottom 0.305: U9.2 52.94,99.07 v52.8,99.21 | v52.86,106.77 53,106.77 53.94,107.71 53.94,123.91 57.82,127.79 84.12,127.79 84.36,127.55 91.98,127.55 92.12,127.41 U8.31
165-LOAD
  Bottom 0.305: U9.1 56.93,97.33 58.7,99.11 58.7,104.07 54.92,107.85 54.92,123.79 56,124.87 59.12,124.87 59.62,124.37 59.62,123.03 60.3,122.35 76.02,122.35 80.76,127.09 83.52,127.09 84.48,126.13 84.48,122.63 84.9,122.21 88.48,122.21 89.92,123.65 89.92,125.85 90.68,126.61 U8.30
165-OUT  (via drill 0.6)
  Top 0.305: v47.04,99.37 51.2,99.37 51.58,99.75 51.58,107.93 v52.52,108.87
  Bottom 0.305: U9.7 46.59,98.91 v47.04,99.37 | v52.52,108.87 52.52,109.01 52.92,109.41 52.92,124.23 57.24,128.55 84.22,128.55 84.56,128.21 U8.32
+3V3  (via drill 0.6)
  Top 0.254: v167.8,96.13 161.6,102.33 v153.3,102.33 v153.3,78.03
  Bottom 0.254: L15.1 144.8,74.03 144.8,73.23 148.6,69.43 Q3.1 | 166.95,64.78 166,63.83 U2.P$21 166,63.73 166,61.93 U2.P$20 | 166.95,64.78 168.9,66.73 168.9,69.03 168.4,69.53 168.4,72.23 R9.2 | 154.14,72.15 154.2,72.03 154.2,70.73 160.1,64.83 166.9,64.83 166.95,64.78 | 149.2,103.53 149.2,103.45 | v167.8,96.13 170.3,96.13 C92.1 | 150.44,102.33 v153.3,102.33 | v153.3,78.03 154.9,76.43 R11.2
  Bottom 0.305: R11.2 154.97,74.22 154.56,73.81 154.56,72.57 154.14,72.15 153.61,72.15 Q2.1 151.17,72.02 150.38,72.81 | Q3.1 148.99,69.3 149.78,70.09 149.78,71.03 150.38,71.63 150.38,72.81 | 150.38,72.81 R39.2 | C90.1 149.2,103.45 149.38,103.45 150.44,102.39 150.44,102.33 150.44,101.4
  Bottom 0.406: 150.44,101.4 U7.1
  Bottom 0.61: C92.1 170.61,96.03 L2.2 173.06,93.68 R26.2
+5V/1  (via drill 0.6)
  Top 1.016: 74.92,49.65 v75.24,49.33
  Top 2: v74.8,149.51 74.8,143.25 71.68,140.13 71.68,100.45 | v124.4,149.77 124.4,143.17 128.34,139.23 128.36,100.09 | 128.36,100.09 128.36,99.89 | 128.36,99.89 128.34,52.79 128.34,52.75 v125.18,49.59 | v75.24,49.33 71.68,52.89 71.68,100.45 | 150.25,118.03 150.25,123.66 151.7,125.11 v152.27,125.11 | 150.25,118.03 150.22,101.09 148.78,100.17 128.22,100.15 128.22,100.03 128.36,99.89 | 71.68,100.45 72.1,100.03 89.78,100.03 95.1,105.35 95.14,105.35 95.7,105.91 104.48,105.91 110.3,100.09 128.36,100.09 | v144.25,124.03 144.25,121.78 146.25,119.78 148.5,119.78 150.25,118.03
  Bottom 1: 168.5,128.31 166.62,128.31 166.1,128.83 157.42,128.83 157.3,128.95 | L4.2 168.76,131.25 D35.C
  Bottom 1.016: 157.3,128.95 C80.2 154.24,128.89 154.24,126.24 153.11,125.11 v152.27,125.11 | 168.5,128.31 L4.2 | Q7.3 124.12,150.04 v124.4,149.77 124.4,148.09 123.81,147.5 Q7.1 | Q9.3 v125.18,49.59 125.28,49.49 125.28,47.61 124.72,47.04 Q9.1 | 75.26,49.31 v75.24,49.33 | Q8.1 75.91,50.55 75.28,49.93 75.28,49.37 v75.24,49.33 | Q8.3 75.75,48.01 75.34,48.43 75.34,49.23 v75.24,49.33 | Q6.3 75.72,148.59 v74.8,149.51 74.86,149.57 74.86,150.55 75.44,151.13 Q6.1 | Q5.8 Q5.7 Q5.6 Q5.5
  Bottom 2: Q5.5 144.87,125.14 144.25,124.53 v144.25,124.03
+5V/2  (via drill 0.6)
  Top 0.254: v97,129.33 96,129.33 v94.2,131.13 | v102.7,48.33 102.7,34.53 ICSP1.2 102.8,34.33 103.9,33.23 103.9,30.23 111.5,22.63 113.4,22.63 120.5,15.53 120.5,12.93 130.7,2.73 169.3,2.73 179.2,12.63 179.2,37.83 178.5,38.53 v178.5,64.63 | v171.9,125.93 v167.5,125.93 | v175.3,125.93 177,125.93 177.3,126.23 178,126.23 178.6,125.63 178.6,107.33 v185,100.93 185,100.83 v181.6,97.43 | v195,95.23 v189.3,100.93 | 179.5,190.53 179.5,182.35 181.72,180.12 181.72,173.72 182.68,172.77 182.68,169.42 180.3,167.04 180.3,167.03 179,165.73 179,158.13 184,153.13 184.7,153.13 v185.6,154.03 | v187.3,151.03 188.7,151.03 188.9,151.23 191,151.23 191.1,151.13 191.1,151.11 191.87,150.34 192.3,150.34 193.73,151.77 193.73,152.49 v193.29,152.92 194.56,152.92 196.06,151.42 196.06,143.7 198.11,141.66 v198.11,136.27 | v76.7,129.43 v76.7,126.93 | v73.9,129.73 73.9,134.53 v73.4,135.03 | v72.3,145.83 72.3,147.53 v70.5,149.33 | v70.8,153.53 69.6,154.73 v69.5,154.73 | v80.2,151.83 80.4,151.83 82.6,154.03 v91.6,154.03 | v104.2,82.33 v106,80.53 | v105.4,118.03 105.4,123.83 103.4,125.83 101.6,125.83 v101.2,125.43 | v92.4,47.93 91.9,47.93 87.9,51.93 82.2,51.93 v74.8,59.33 | v73.4,72.13 v73.4,65.53 | v84.2,71.73 88.8,71.73 97.4,80.33 97.4,88.33 ICSP.2 | v181.1,94.53 180.3,94.53 177.4,91.63 176.7,91.63 175.6,92.73 175,92.73 174.4,92.13 174.4,91.53 177.4,88.53 177.4,86.53 175.5,84.63 v175.5,66.13 | v202.62,134.56 202.62,137.47 S1.2 201.19,137.55 v199.91,136.27
  Top 0.305: v179.75,190.78 179.5,190.53
  Bottom 0.254: v94.2,131.13 94.27,131.2 | v97,129.33 97,129.09 99.86,126.23 99.86,125.75 100.85,124.76 | 100.85,124.76 101.54,124.07 | 100.96,125.43 100.96,125.87 103.3,128.21 103.98,128.21 | 100.96,125.43 100.96,124.87 100.85,124.76 | 102.7,48.69 v102.7,48.33 | R10.2 98.7,65.43 98.7,69.23 102.5,73.03 102.5,74.73 103.38,75.61 C94.1 103.3,75.73 98.1,80.93 98.1,82.33 D16.C | 103.41,75.63 103.86,75.63 104.5,74.99 105.92,74.99 106.02,75.09 U1.5 106,75.73 v106,80.53 | v167.5,125.93 168.7,125.93 L4.1 | v175.3,125.93 v171.9,125.93 | v189.3,100.93 v185,100.93 | v195,95.23 195,126.97 195.68,127.65 195.71,127.65 v202.62,134.56 | v185.6,154.03 185.6,152.73 v187.3,151.03 | v76.7,126.93 73.6,126.93 72.7,126.03 71.5,126.03 L3.1 | v76.7,129.43 74.2,129.43 v73.9,129.73 | v73.4,135.03 73.4,135.73 72.3,136.83 v72.3,145.83 | v70.5,149.33 70.5,153.23 v70.8,153.53 | v69.5,154.73 70.1,154.73 70.5,155.13 74.7,155.13 76.5,153.33 78.7,153.33 v80.2,151.83 | v104.2,82.33 104.2,93.03 103.6,93.63 103.6,95.23 104.9,96.53 104.9,99.63 105.4,100.13 v105.4,118.03 | 100.96,125.43 v101.2,125.43 | v92.4,47.93 95.5,47.93 U12.18 | v74.8,59.33 72.6,61.53 72.6,64.73 v73.4,65.53 | v73.4,72.13 83.8,72.13 v84.2,71.73 | 93.18,133.79 93.2,133.83 C4.1 93.19,136.07 C3.1 93.1,136.23 91.6,137.73 v91.6,154.03 93.15,155.58 93.15,159.21 | v181.6,97.43 181.6,95.03 v181.1,94.53 | v175.5,66.13 177,66.13 v178.5,64.63 | v193.29,152.92 201.4,152.92 202.79,154.32 202.79,155.45 TX_USB.A | v199.91,136.27 v198.11,136.27
  Bottom 0.305: D16.C 98.1,84.14 R6.2 97.46,86.92 ICSP.2 | U8.34 94.66,130.81 94.27,131.2 93.18,132.29 93.18,133.79 | U8.14 101.54,124.07 | 103.98,128.21 U8.2 | U12.4 105.36,50.29 106.02,49.63 106.02,49.61 106.94,48.69 | 106.94,48.69 U12.6 103.06,48.69 v102.7,48.33 | 106.94,48.69 109.07,48.69 C72.1 | 102.7,48.69 100.08,48.69 99.28,47.89 U12.18 | ICSP1.2 102.78,34.44 102.78,33.59 102.38,33.19 96.52,33.19 95.87,33.84 R17.2 | 103.41,75.63 C94.1 | R10.2 R8.2 | RX_USB.A TX_USB.A | C81.1 99.54,175.17 99.54,173.95 98.9,173.3 U11.8 98.23,173.32 98.23,174.27 97.39,175.12 R41.1 94.36,175.12 94,174.77 94,170.68 93.15,169.82 93.15,159.21 | Q4.1 171.32,192.71 171.75,192.28 176,192.28 176.25,192.53 178,192.53 v179.75,190.78
A  (via drill 0.6)
  Top 0.254: v115,4.23 106.7,4.23 v95.3,15.63
  Top 0.305: v47.22,28.89 47.22,5.21 v47.38,5.05
  Bottom 0.254: 125.3,4.23 125.3,5.53 D26.3 | 125.3,4.23 126,3.53 173,3.53 175,5.53 D27.3 | R35.2 22.6,5.73 25.4,5.73 D18.3 | v47.38,5.05 47.5,5.13 48.6,6.23 64.4,6.23 65,5.63 75,5.63 D19.3 75.2,5.63 75.8,6.23 86.2,6.23 95.3,15.33 v95.3,15.63 | v115,4.23 125.3,4.23
  Bottom 0.305: v47.22,28.89 51.66,33.33 U9.3 | v47.38,5.05 39.32,5.05 36.6,2.33 28.98,2.33 D18.3
  Bottom 0.406: 25.56,5.77 D18.3
AREF
  Bottom 0.305: U8.42 101.54,134.49 C2.2
AREFB
  Bottom 0.254: 91.12,48.87 C73.1
  Bottom 0.305: U12.20 91.74,49.49 91.12,48.87
AVCC  (via drill 0.6)
  Top 0.254: v90.37,121.68 89.15,121.68 88.81,121.34 83.87,121.34 82.44,119.9 80.37,119.9 v80.3,119.84 | v69.3,120.31 69.3,123.61 v69.27,123.65
  Top 0.305: v97.77,123.21 99.02,123.21 99.43,123.62 99.43,126.43 v100.22,127.23
  Bottom 0.254: v100.22,127.23 101.4,127.23 103.18,129.01 | C6.2 74.2,123.83 71.5,123.83 L3.2 71.34,123.65 v69.27,123.65 | U8.24 90.5,121.81 v90.37,121.68 | v80.3,119.84 69.77,119.84 v69.3,120.31
  Bottom 0.305: U8.44 103.18,130.77 103.18,129.01 | U8.24 96.37,121.81 v97.77,123.21
AWAKE  (via drill 0.6)
  Top 0.254: v111.3,128.23 112.6,128.23 113.6,129.23 115.5,129.23 122.1,122.63 122.1,106.43 125.3,103.23 v126.6,103.23 | v105.86,130.79 103.98,132.67 v100.46,132.67
  Bottom 0.254: v111.3,128.23 109.8,128.23 107.24,130.79 v105.86,130.79 | v126.6,103.23 144.8,103.23 147.2,105.63 154.1,105.63 157.9,101.83 157.9,100.13 156.47,98.69 156,98.69 | U8.40 99.94,132.15 v100.46,132.67
  Bottom 0.305: U7.5 156,98.69
B  (via drill 0.6)
  Top 0.254: v84.6,24.33 84.8,24.33 86.5,22.63 97.1,22.63 v100.2,25.73 | v141.76,26.73 139.2,26.73 136.7,29.23 131.6,29.23 v131.3,29.53 | v60,50.43 v50.8,50.43 | v62.3,50.43 63,50.43 71.2,42.23 71.2,37.83 73.8,35.23 v73.8,31.43
  Bottom 0.254: R36.2 22.5,30.63 25.3,30.63 D20.3 | v84.6,24.33 81.1,27.83 76.5,27.83 75.1,29.23 75.1,30.63 D21.3 75,30.23 v73.8,31.43 | v100.2,25.73 100.2,26.93 99.6,27.53 99.6,28.13 101.4,29.93 107.8,29.93 109.1,31.23 124.8,31.23 125.3,30.73 D28.3 125.4,30.53 126.4,29.53 v131.3,29.53 | v141.76,26.73 157.2,26.73 161.1,30.63 175,30.63 D29.3 | v50.8,50.43 50.4,50.43 | v62.3,50.43 v60,50.43
  Bottom 0.305: D20.3 25.62,30.45 27.48,30.45 28.56,31.53 41.76,31.53 50.4,40.16 50.4,50.43 U9.4
  Bottom 0.406: 25.42,30.61 D20.3
C  (via drill 0.6)
  Top 0.254: v65,54.23 59,54.23 v55.4,57.83 | v48.6,64.63 v52.6,60.63 | v150.6,39.03 150.6,16.03 v145.8,11.23 | v126.3,4.43 116.4,4.43 114.6,2.63 105.8,2.63 103.5,4.93 91.9,4.93 89.6,2.63 84.4,2.63 78.1,8.93 78.1,33.53 77.6,34.03 77.6,52.93 v76.1,54.43
  Bottom 0.254: 150.6,48.63 156.4,48.63 D31.3 | 150.6,48.63 139.9,48.63 131.8,56.73 126.3,56.73 125.2,55.63 125,55.63 D30.3 | R37.2 22.4,55.73 25.3,55.73 D22.3 | v52.6,60.63 v55.4,57.83 | v48.6,64.63 48.53,64.7 | v150.6,39.03 150.6,48.63 | v145.8,11.23 141.9,11.23 135.1,4.43 v126.3,4.43 | v65,54.23 65,53.33 66.54,51.79 68.42,51.79 D23.3 71.14,51.85 73.72,54.43 v76.1,54.43 | v76.1,54.43
  Bottom 0.305: D22.3 27.92,53.17 37,53.17 48.53,64.7 49.12,65.29 U9.5
CHG  (via drill 0.6)
  Top 0.254: v97.1,57.13 94.4,57.13 91,53.73 82.6,53.73 79.1,57.23 79.1,57.93 78.46,58.57 78.46,65.11 78.28,65.29 78.28,77.09 78.68,77.49 78.7,82.63 77.82,83.51 77.82,83.87 77.44,84.25 v77.44,84.45 | v52.6,88.83 51.4,88.83 45.2,95.03 45.2,107.93 46.8,109.53 46.8,120.73 53.3,127.23 v53.32,127.35 | 56.68,198.11 91.32,198.11 96.1,193.33 103.94,193.33 108.72,198.11 108.8,198.03 v137.3,198.03 | v146,187.23 150.95,187.23 160.28,196.56 v161.74,196.56
  Top 0.305: 56.68,198.11 v52.94,194.37
  Bottom 0.254: v52.6,88.83 61,88.83 64.7,85.13 76.76,85.13 v77.44,84.45 | v97.1,57.13 97.19,57.22 | v146,187.23 139.3,193.93 139.3,196.03 v137.3,198.03 | D42.A 164,194.73 163.57,194.73 v161.74,196.56
  Bottom 0.305: U12.26 97.88,56.53 97.19,57.22 96.82,57.59 | v52.94,194.37 52.94,127.73 v53.32,127.35
  Bottom 0.61: R23.2 164.18,194.32 D42.A
CMP
  Bottom 0.305: 97.34,168.48 R16.2 R15.1 | R15.1 C82.2 | U11.5 98.25,170.85 99.36,169.74 99.36,168.48 R15.1
D  (via drill 0.6)
  Top 0.254: v165,79.23 v156.1,79.23 156.1,70.03 v153.3,67.23 | v67.5,80.53 66.9,80.53 65.6,79.23 | 65.6,79.23 55.3,79.23 v48.1,86.43 | v149.7,63.63 149.7,16.43 v145.9,12.63 | v106.1,3.53 105.6,3.53 103.7,5.43 91.7,5.43 89.4,3.13 84.6,3.13 78.6,9.13 78.6,33.73 78.1,34.23 78.1,53.83 75.6,56.33 75.6,56.71 v74.74,57.57 | v69.9,66.43 69.9,74.83 65.6,79.13 65.6,79.23
  Bottom 0.254: v165,79.23 166.4,80.63 174.9,80.63 D33.3 | v156.1,79.23 155.6,79.23 151,83.83 126.9,83.83 126.8,83.93 125.5,83.93 125.3,83.73 125.3,80.73 D32.3 | R38.2 22.5,80.63 25.3,80.63 D24.3 | 47.12,87.41 v48.1,86.43 | v149.7,63.63 v153.3,67.23 | v145.9,12.63 142.6,12.63 136.7,6.73 112.9,6.73 109.7,3.53 v106.1,3.53 | D25.3 68.74,79.29 v67.5,80.53 | v69.9,66.43 74.8,66.43 76.5,64.73 77.34,64.73 78.26,63.81 78.26,59.51 76.32,57.57 v74.74,57.57
  Bottom 0.305: D24.3 27.12,78.95 38.66,78.95 47.12,87.41 47.85,88.14 U9.6
D+  (via drill 0.6)
  Top 0.305: X2.P3 204.02,188.53
  Top 0.406: v200.14,188.77 202.5,188.77 202.74,188.53 204.02,188.53
  Bottom 0.406: Z1.1 R2.1 200.13,188.79 v200.14,188.77
D-  (via drill 0.6)
  Top 0.305: X2.P2 204.04,187.87 204.02,187.88
  Top 0.406: v198.93,191.05 198.93,187.57 199.53,186.97 200.51,186.97 201.42,187.88 204.02,187.88
  Bottom 0.406: 196.13,192.56 Z2.1 196.11,192.48 R4.1 198.75,190.87 v198.93,191.05
DO  (via drill 0.6)
  Top 0.254: v12.3,8.93 12.8,9.43 12.8,11.33 11.9,12.23 10.1,12.23 B3.2A | v11.4,122.13 v9.2,119.93 | v35.7,122.13 38.9,122.13 40.5,120.53 45.3,120.53 53,128.23 54.02,128.23 54.86,127.39 54.86,125.73 56.9,123.69 v57.18,123.69 | 88.88,122.67 88.88,122.65 88.3,122.07 81.34,122.07 v81.1,121.83 | v57.46,120.91 v59.78,120.91
  Top 0.305: v95.58,126.87 93.1,126.87 89.5,123.27 89.48,123.27 88.88,122.67
  Bottom 0.254: v12.3,8.93 11.3,8.93 10.4,8.03 10.4,4.93 9.9,4.43 9.1,4.43 6.9,6.63 6.9,117.63 v9.2,119.93 | v35.7,122.13 v11.4,122.13 | v57.46,120.91 57.46,123.41 v57.18,123.69 | v59.78,120.91 59.78,121.01 60.24,121.47 80.74,121.47 v81.1,121.83
  Bottom 0.305: U8.27 94.64,124.21 95.26,124.83 95.26,126.55 v95.58,126.87
DO1  (via drill 0.6)
  Top 0.254: v10.6,90.33 10.1,89.83 10.1,89.03 B3.1D | v11.9,111.83 10.5,111.83 10.1,112.23 B1.2A
  Bottom 0.254: v10.6,90.33 10.6,90.83 8.6,92.83 8.6,108.53 v11.9,111.83
DO2  (via drill 0.6)
  Top 0.254: v10.6,190.33 10.1,189.83 10.1,189.03 B1.1D | v29.3,195.33 v10.2,195.33 | v36.9,187.73 35.5,187.73 35.1,187.33 B1.2H
  Bottom 0.254: v10.6,190.33 10.6,194.93 v10.2,195.33 | v36.9,187.73 v29.3,195.33
DO3  (via drill 0.6)
  Top 0.254: v36.7,89.93 36.7,88.53 35.5,87.33 35.1,87.33 B3.2H | v30.6,92.83 30.6,94.03 v32.3,95.73 | v41.3,104.73 45.9,109.33 v45.9,112.13 | v36.9,113.53 35.5,113.53 35.1,113.93 B1.1E
  Bottom 0.254: v36.7,89.93 33.5,89.93 v30.6,92.83 | v41.3,104.73 v32.3,95.73 | v45.9,112.13 38.3,112.13 v36.9,113.53
DO4  (via drill 0.6)
  Top 0.254: v38.1,13.93 35.1,13.93 B3.1E | v62.2,13.23 61.4,13.23 60.5,12.33 60.1,12.33 B3.2I
  Bottom 0.254: v38.1,13.93 61.5,13.93 v62.2,13.23
DO5  (via drill 0.6)
  Top 0.254: v61.3,90.23 60.1,89.03 B3.1L | v61.9,111.83 60.5,111.83 60.1,112.23 B1.2I
  Bottom 0.254: v61.3,90.23 61.3,93.53 59.2,95.63 59.2,104.33 58.6,104.93 58.6,108.53 v61.9,111.83
DO6  (via drill 0.6)
  Top 0.254: v60.8,190.43 60.1,189.73 60.1,189.03 B1.1L | v86.9,187.83 85.6,187.83 85.1,187.33 B1.2P
  Bottom 0.254: v60.8,190.43 60.8,194.43 60.7,194.53 60.7,195.83 61,196.13 78.6,196.13 v86.9,187.83
DO7  (via drill 0.6)
  Top 0.254: v86.9,87.83 86.4,87.33 85.1,87.33 B3.2P | v80,92.23 80,94.53 v83.7,98.23 | v87.9,113.93 85.1,113.93 B1.1M
  Bottom 0.254: v86.9,87.83 84.4,87.83 v80,92.23 | v83.7,98.23 83.7,103.23 89.5,109.03 89.5,112.33 v87.9,113.93
DO8  (via drill 0.6)
  Top 0.254: v111.5,9.13 112.8,10.43 112.8,11.33 111.9,12.23 110.1,12.23 B4.2A | v89,4.03 84.4,4.03 79.5,8.93 v79.5,17.63 | v85.6,15.33 85.6,14.53 85.1,14.03 B3.1M
  Bottom 0.254: v111.5,9.13 110.4,8.03 110.4,4.93 109.9,4.43 104,4.43 103.5,4.93 89.9,4.93 v89,4.03 | v79.5,17.63 83.3,17.63 v85.6,15.33
DO9  (via drill 0.6)
  Top 0.254: v110.6,90.33 110.1,89.83 110.1,89.03 B4.1D | v111.2,96.43 v110,95.23 | v116.3,104.73 120.5,108.93 v120.5,109.63 | v112.2,113.13 111.3,113.13 110.5,112.33 110.1,112.33 B2.2A
  Bottom 0.254: v110.6,90.33 110.6,94.63 v110,95.23 | v111.2,96.43 111.2,99.63 v116.3,104.73 | v120.5,109.63 116.9,109.63 113.4,113.13 v112.2,113.13
DO10  (via drill 0.6)
  Top 0.254: v136.9,187.23 135.1,187.23 B2.2H | v111.9,188.33 110.7,188.33 110.1,188.93 B2.1D
  Bottom 0.254: v136.9,187.23 128.1,187.23 126,185.13 120.8,185.13 117.6,188.33 v111.9,188.33
DO11  (via drill 0.6)
  Top 0.254: v136.8,90.73 136.8,88.63 135.5,87.33 135.1,87.33 B4.2H | v123.2,94.73 v126.6,91.33 | v138.1,110.53 138.1,110.73 136.5,112.33 136.5,112.93 135.5,113.93 135.1,113.93 B2.1E
  Bottom 0.254: v136.8,90.73 136.4,90.73 135.8,91.33 v126.6,91.33 | v123.2,94.73 123.2,95.83 123.6,96.23 123.6,106.03 124.4,106.83 124.7,106.83 125.1,107.23 125.1,108.73 125.7,109.33 136.9,109.33 v138.1,110.53
DO12  (via drill 0.6)
  Top 0.254: v161.9,12.23 160.1,12.23 B4.2I | v148.8,12.23 140.8,4.23 132.7,4.23 128.6,8.33 v128.6,10.83 | v135.6,15.33 135.6,14.53 135.1,14.03 B4.1E
  Bottom 0.254: v148.8,12.23 v161.9,12.23 | v128.6,10.83 131.1,10.83 v135.6,15.33
DO13  (via drill 0.6)
  Top 0.254: v161.3,90.23 160.1,89.03 B4.1L | v161.9,110.83 160.5,112.23 160.1,112.23 B2.2I
  Bottom 0.254: v161.3,90.23 161.3,92.93 160.7,93.53 160.7,103.53 161,103.83 161,107.03 160.6,107.43 160.6,109.53 v161.9,110.83
DO14  (via drill 0.6)
  Top 0.254: v186.9,186.63 186.3,187.23 185.1,187.23 B2.2P | v176.9,191.43 174.7,191.43 v173.5,190.23 | v161.9,188.63 160.4,188.63 160.1,188.93 B2.1L
  Bottom 0.254: v186.9,186.63 181.1,186.63 176.9,190.83 v176.9,191.43 | v173.5,190.23 170.5,190.23 168.9,188.63 v161.9,188.63
DO15  (via drill 0.6)
  Top 0.254: v188,90.13 188.2,89.93 188.2,88.73 187.6,88.13 187.4,88.13 186.6,87.33 185.1,87.33 B4.2P | v186.7,114.93 186,114.93 185.1,114.03 B2.1M
  Bottom 0.254: v188,90.13 188.3,90.13 189,89.43 189.6,89.43 190.2,90.03 190.2,110.93 186.7,114.43 v186.7,114.93
DTR  (via drill 0.6)
  Top 0.254: v79.5,34.73 79.5,40.53 81.9,42.93 v81.9,50.59 | v83.1,55.13 83.1,55.33 79.5,58.93 79.5,65.53 80,66.03 80.3,66.03 80.54,66.27 80.54,71.27 81.9,72.63 89,72.63 96.3,79.93 96.3,92.83 100,96.53 100,98.53 101.5,100.03 v104.1,100.03
  Bottom 0.254: v79.5,34.73 80.3,33.93 90.6,33.93 C93.2 | v81.9,50.59 81.9,53.93 v83.1,55.13 | v104.1,100.03 104.1,100.73 104.9,101.53 104.9,116.03 104.6,116.33 104.6,116.45
  Bottom 0.305: U8.12 103.14,117.91 104.6,116.45
E  (via drill 0.6)
  Top 0.254: v61.9,101.23 60,101.23 58.5,102.73 55.3,102.73 53.7,101.13 53.7,98.93 53.1,98.33 46.9,98.33 46.2,99.03 46.2,100.43 v47.5,101.73 | v156.8,106.13 159.7,103.23 166.9,103.23 | v172.5,103.23 166.9,103.23 | v85,95.23 93.4,95.23 v95.5,93.13 | v101.5,73.23 103.4,71.33 104.8,71.33 106.1,72.63 106.1,76.93 106.7,77.53 v116.4,77.53 | v155.5,67.03 156,67.03 161.1,72.13 168.7,72.13 170.5,73.93 170.5,92.23 v168.4,94.33 | 166.9,103.23 v166.9,99.73
  Bottom 0.254: v61.9,101.23 66.2,105.53 75.3,105.53 D2.3 75.3,105.43 77,105.43 79,103.43 79,97.43 80.4,96.03 81.7,96.03 82.5,95.23 v85,95.23 | v47.5,101.73 47.5,103.13 47.8,103.43 U9.11 | v156.8,106.13 147,106.13 144.6,103.73 127.6,103.73 125.7,105.63 125,105.63 D9.3 | D10.3 v172.5,103.23 | v95.5,93.13 95.5,87.83 97,86.33 97,77.73 v101.5,73.23 | v116.4,77.53 121.1,72.83 136.5,72.83 136.7,72.63 142.1,72.63 149.1,65.63 150.5,65.63 153,68.13 154.4,68.13 v155.5,67.03 | v168.4,94.33 166.9,95.83 v166.9,99.73
  Bottom 0.305: U9.11 47.85,106.25 47.26,106.85 39.96,106.85 37.26,104.15 26.8,104.15 D1.3 R31.2
  Bottom 0.406: 25.26,105.67 D1.3
F  (via drill 0.6)
  Top 0.254: v69.8,129.43 69.8,128.93 60.9,120.03 57.6,120.03 55.7,118.13 54.4,118.13 v49.5,113.23 | v131,128.53 131,121.83 v133.2,119.63 | v173.7,130.23 171.78,128.31 166.42,128.31 165.34,127.23 165.34,123.87 162.6,121.13 v160.8,121.13 | v77,131.43 76.98,132.19 77.98,133.19 78,143.23 v82.3,147.53 | v85.3,152.33 v82.3,149.33 | v109.2,150.63 v87.8,150.63 | v111.6,150.63 111.6,150.13 120.6,141.13 v121.1,141.13
  Bottom 0.254: v69.8,129.43 71,130.63 75.6,130.63 D4.3 75.8,130.63 76.2,130.63 v77,131.43 | 49.12,113.23 v49.5,113.23 | v133.2,119.63 140,112.83 152.5,112.83 v160.8,121.13 | v173.7,130.23 174.5,130.23 174.9,130.63 D12.3 | v82.3,149.33 v82.3,147.53 | v85.3,152.33 86.1,152.33 v87.8,150.63 | v111.6,150.63 v109.2,150.63 | v121.1,141.13 121.1,136.73 124.1,133.73 124.1,130.83 D11.3 124.2,130.63 126.24,130.63 127.64,129.23 130.3,129.23 v131,128.53
  Bottom 0.305: U9.12 49.12,113.23 49.12,120.52 41.32,128.33 27.6,128.33 D3.3 R32.2
FACTORY  (via drill 0.6)
  Top 0.254: v97.4,111.93 100.12,114.65 100.12,125.59 101.6,127.07 v101.6,128.73 | v98.6,107.63 104.7,107.63 110.9,101.43 126.2,101.43 v126.6,101.83 | v139.8,98.43 v137.4,98.43
  Bottom 0.254: v101.6,128.73 100.8,129.53 100.8,130.73 U8.41 | v97.4,111.93 97.4,108.83 v98.6,107.63 | v126.6,101.83 134,101.83 v137.4,98.43 | v139.8,98.43 140.7,97.53 140.68,97.45
  Bottom 0.305: U7.9 141.38,96.74 140.68,97.45
G  (via drill 0.6)
  Top 0.254: v118.4,155.63 117.9,155.63 115.5,153.23 v109.1,153.23 | v105.6,149.73 86.9,149.73 v83.5,146.33 | v178.8,146.93 168.5,146.93 167.8,147.63 v164.9,147.63 | v163.7,148.83 162.7,148.83 v161.4,150.13 | v128.9,152.53 129.8,151.63 131.8,151.63 132.1,151.93 v161.4,151.93 | v50.8,140.53 53.8,140.53 63.3,150.03 v66.7,150.03
  Bottom 0.254: v118.4,155.63 123.5,155.63 | 123.5,155.63 124.7,155.63 D13.3 | v105.6,149.73 v109.1,153.23 | v83.5,146.33 83.5,149.73 77.6,155.63 75.9,155.63 D6.3 75.8,155.63 69.1,155.63 66.7,153.23 v66.7,150.03 | v178.8,146.93 179.8,147.93 179.8,148.33 D14.3 | v163.7,148.83 v164.9,147.63 | v161.4,151.93 v161.4,150.13 | v128.9,152.53 126.5,152.53 123.5,155.53 123.5,155.63 | v50.8,140.53 50.5,140.53 50.4,140.47 | v66.7,150.03
  Bottom 0.305: U9.13 50.4,140.47 37.28,153.59 27.08,153.59 D5.3 R33.2
  Bottom 0.406: 25.02,155.63 D5.3
G1  (via drill 0.6)
  Top 0.254: v38.1,147.13 57.9,147.13 62.8,152.03 77.84,152.03 v78.22,152.41 | v28.9,146.93 28.9,137.43 27.4,135.93 27.4,84.43 22.6,79.63 22.6,18.33 27.7,13.23 27.7,9.83 34.9,2.63 65.6,2.63 71.6,8.63 71.6,16.53 75.8,20.73 75.8,29.23 v76.7,30.13 | v81.5,30.13 83.3,28.33 86.7,28.33 87.1,28.73 94.5,28.73 v95.1,29.33 | v96.4,30.63 96.2,30.63
  Top 0.305: v96.2,42.99 96.2,30.63 96.2,30.31 97.24,29.27 102.24,29.27 103.06,30.09 103.06,31.62 ICSP1.1
  Bottom 0.254: v78.22,152.41 78.5,152.03 79,151.53 79,150.73 78.2,149.93 77.5,149.93 Q6.2 | v38.1,147.13 35.9,147.13 32.8,150.23 32.2,150.23 v28.9,146.93 | v81.5,30.13 v76.7,30.13 | v96.4,30.63 v95.1,29.33
  Bottom 0.305: U12.16 97.08,43.87 v96.2,42.99
G2  (via drill 0.6)
  Top 0.254: v64.3,146.13 60.1,146.13 41.2,127.23 v41.2,121.43 | v30.7,117.93 30.7,117.43 29,115.73 29,103.73 v30,102.73 | v23.5,96.23 22.3,96.23 20.5,94.43 20.5,85.23 20.2,84.93 20.2,82.63 19.8,82.23 19.8,80.13 v20.7,79.23 | v46,63.43 46,39.03 54.5,30.53 54.5,8.93 59.9,3.53 65.8,3.53 71.1,8.83 71.1,16.73 72.3,17.93 v72.3,35.53 | v72.1,41.83 72.1,49.43 v70.9,50.63 | v87.6,50.13 87.6,49.83 89.1,48.33 89.68,48.33 91.56,46.45 96.54,46.45 97.88,45.11 97.88,44.35 v98,44.23
  Top 0.305: ICSP1.4 100.26,34.5 100.26,35.21 100.24,35.23 100.24,39.77 99.66,40.35 v99.12,40.35
  Bottom 0.254: v64.3,146.13 67.4,149.23 69.3,149.23 69.6,149.53 69.6,153.57 70.7,154.67 73.24,154.67 73.84,154.07 73.84,148.75 75.26,147.33 77.4,147.33 Q6.4 | v41.2,121.43 41.2,117.03 38.7,114.53 34.1,114.53 v30.7,117.93 | v23.5,96.23 v30,102.73 | v20.7,79.23 26.1,79.23 34.8,70.53 38.9,70.53 v46,63.43 | v72.3,35.53 72.3,36.03 72.1,36.23 v72.1,41.83 | v70.9,50.63 73.8,53.53 76.5,53.53 79.5,56.53 84.6,56.53 87.6,53.53 v87.6,50.13 | v98,44.23 97.88,44.23
  Bottom 0.305: U12.15 97.88,44.23 97.88,41.59 v99.12,40.35
G3  (via drill 0.6)
  Top 0.254: v113.9,128.33 113.9,127.03 v115.5,125.43 | v118.7,122.23 118.7,117.33 121.4,114.63 121.4,106.63 v117.1,102.33 | v112.1,97.33 110.9,97.33 v107.5,93.93 | v107,76.63 107,72.13 v106.8,71.93
  Bottom 0.254: v113.9,128.33 110.1,132.13 110.1,135.73 118.3,143.93 118.3,145.93 121.1,148.73 121.7,148.73 Q7.2 | v118.7,122.23 v115.5,125.43 | v112.1,97.33 v117.1,102.33 | v107.5,93.93 107.5,81.03 107,80.53 v107,76.63 | v106.8,71.93 106.8,54.73 108.6,52.93 108.7,52.83
  Bottom 0.305: U12.2 107.76,51.89 108.7,52.83
G4  (via drill 0.6)
  Top 0.254: v104.1,55.53 104.1,57.53 102.8,58.83 v102.8,63.93 | v101.6,65.13 102.1,65.13 108.3,71.33 109.3,71.33 110.2,72.23 v110.2,72.63 | v122.9,71.93 122.9,84.73 121.7,85.93 v121.7,97.33 | v123,106.73 123,111.13 122.6,111.53 122.6,114.03 v126.6,118.03 | v130.1,121.53 130.1,129.83 v131.6,131.33 | v128.92,142.45 128.92,149.35 v129.7,150.13
  Bottom 0.254: v104.1,55.53 104.1,52.83 U12.1 | v101.6,65.13 v102.8,63.93 | v110.2,72.63 118.5,72.63 119.2,71.93 v122.9,71.93 | v121.7,97.33 121.7,105.43 v123,106.73 | v130.1,121.53 v126.6,118.03 | v131.6,131.33 136.3,131.33 137.5,132.53 137.5,133.73 135.58,135.65 134.94,135.65 128.92,141.67 v128.92,142.45 | v129.7,150.13 129.7,150.53 128.2,152.03 122.5,152.03 121.8,151.33 Q7.4
G5
  Bottom 0.305: U12.12 100.28,38.01 99.58,37.31 85.54,37.31 80.06,42.79 80.06,48.77 79.6,49.23 77.97,49.23 Q8.2
G6
  Bottom 0.305: U12.11 101.08,37.07 100.52,36.51 84.68,36.51 77.86,43.33 77.86,46.68 Q8.4
G7
  Bottom 0.305: U12.10 101.88,39.07 106.5,34.45 114.9,34.45 117.68,37.23 117.68,45.67 120.3,48.29 122.66,48.29 Q9.2
G8
  Bottom 0.305: U12.9 102.68,39.53 106.88,35.33 114.52,35.33 116.88,37.69 116.88,47.47 120.22,50.81 122.64,50.81 Q9.4
GATE_CMD  (via drill 0.6)
  Top 0.254: v84.6,102.53 84.4,102.53 79,107.93 79,115.63 77.7,116.93 77.7,121.03 79.9,123.23 79.9,132.13 78.5,133.53 78.5,142.53 87.84,151.87 v90.3,151.87 | v150.5,136.03 150.5,137.23 150.1,137.63 150.1,140.03 149.1,141.03 149.1,144.23 v152.7,147.83 | v154.33,155.11 155.8,155.13 156.6,155.93 156.6,156.83 154.5,158.93 v154.5,166.33 154.4,165.93 150.37,165.93 150.06,166.23 150.06,167.42 149.77,167.72 148.58,167.72 148.1,168.19 148.1,176.23 149.5,177.63 149.5,178.23 148.9,178.83 148,178.83 146.6,177.43 136.5,177.43 136.1,177.03 132.6,177.03 131.46,178.17 125.95,178.17 124.84,179.27 124.83,179.26 120.57,179.26 120.28,178.97 108.99,178.97 108.69,179.27 101.7,179.27 100.75,178.33 v99.9,178.33
  Top 0.305: v95.99,171.62 93.45,171.62 v92.85,171.02
  Bottom 0.254: v84.6,102.53 90.7,96.43 90.7,71.79 92.06,70.43 93.92,70.43 94.92,69.43 94.92,67.25 92.8,65.13 92.8,54.83 92.72,54.75 | 90.3,166.78 v90.3,151.87 | 98.7,178.33 v99.9,178.33 | v99.9,178.33 | v154.5,166.33 154.5,167.43 154.2,167.73 Q1.1 154.2,167.83 154.2,171.03 155.2,172.03 155.2,186.03 157.5,188.33 157.5,193.83 161.2,197.53 162.5,197.53 163.14,196.89 D41.A | v154.33,155.11 154.33,149.46 v152.7,147.83 | U11.7 97.21,172.65 | v150.5,136.03 150.5,133.97 152.26,132.21 152.26,128.27 151.68,127.69 Q5.2
  Bottom 0.305: U12.24 94.78,52.69 92.72,54.75 | D36.A 146.86,123.03 146.86,126.83 147.66,127.63 150.06,127.63 Q5.2 | 98.7,178.33 95.42,178.33 92.62,175.53 92.62,171.25 v92.85,171.02 92.85,170.56 90.3,168.01 90.3,166.78 | 97.21,172.65 97.02,172.65 v95.99,171.62
GND  (via drill 0.6)
  Top 0.254: v183.5,195.73 183.5,197.63 183.2,197.93 183.2,198.53 183.8,199.13 191.6,199.13 198,192.73 198,183.53 195.8,181.33 v195.8,180.93 | v179.4,134.33 179.4,134.03 184.2,129.23 190.7,129.23 v191.2,129.73 | v194.86,182.53 194.8,182.43 194.4,182.43 190,178.03 190,170.93 192.4,168.53 192.5,168.53 197.8,163.23 197.8,161.49 202.53,156.76 RST.1 202.53,152.74 v202.76,152.51 | v148.9,95.93 148.9,92.83 149.1,92.63 149.1,88.93 148.5,88.33 148.5,82.73 146.1,80.33 v146.1,79.63 146.1,71.03 147.9,69.23 v147.9,61.23 | v175.2,94.43 v177.1,92.53 | v192.2,51.63 v184,51.63 | v107.5,173.93 108.8,172.63 113.5,172.63 114.6,173.73 135.3,173.73 136.4,172.63 138.3,172.63 138.5,172.83 v141.2,172.83 | v20.2,173.13 20.2,164.33 20.5,164.03 v20.5,156.93 | v103.6,35.93 v103.6,39.83 103.6,48.83 v102.8,49.63 | v103.3,72.63 103.3,87.63 102.6,88.33 ICSP.6 | v94,67.53 98.3,67.53 v100.1,69.33 | v20.8,7.03 v20.8,29.33 20.8,29.43 20.5,29.73 20.5,34.93 20.6,35.03 v20.6,48.53 20.6,64.63 19.8,65.43 v19.8,69.83 | v22.6,95.33 22.6,82.03 v22.7,81.93 | v28.3,103.23 v28.3,129.23 | v104,180.53 104,182.03 90.8,195.23 59.2,195.23 v40.3,176.33 | v99.66,135.31 96.24,135.31 95.74,135.81 95.74,141.63 v95.8,141.69 | v194.3,78.91 194.3,78.31 191.84,75.85 v190.26,75.85 | v66.6,126.93 66.6,127.43 v69.9,130.73 | v65.8,149.13 v70.7,144.23 | v65.8,153.53 65.2,153.53 64.5,154.23 59.2,154.23 47.5,165.93 v47.5,168.43 | v153.5,144.63 v153.5,138.63 | v143.62,147.23 v150.9,147.23 | v120.2,33.83 120.2,21.43 127.7,13.93 127.7,8.53 132.5,3.73 168.4,3.73 v171.4,6.73
  Top 0.305: v194.86,182.53 195.56,182.53 196.92,183.89 196.92,192.33 194.62,194.63 193.32,194.63 v192.86,194.17